# Altium schematic sheet Hotels_Lock_Main_V1.SchDoc
size A3
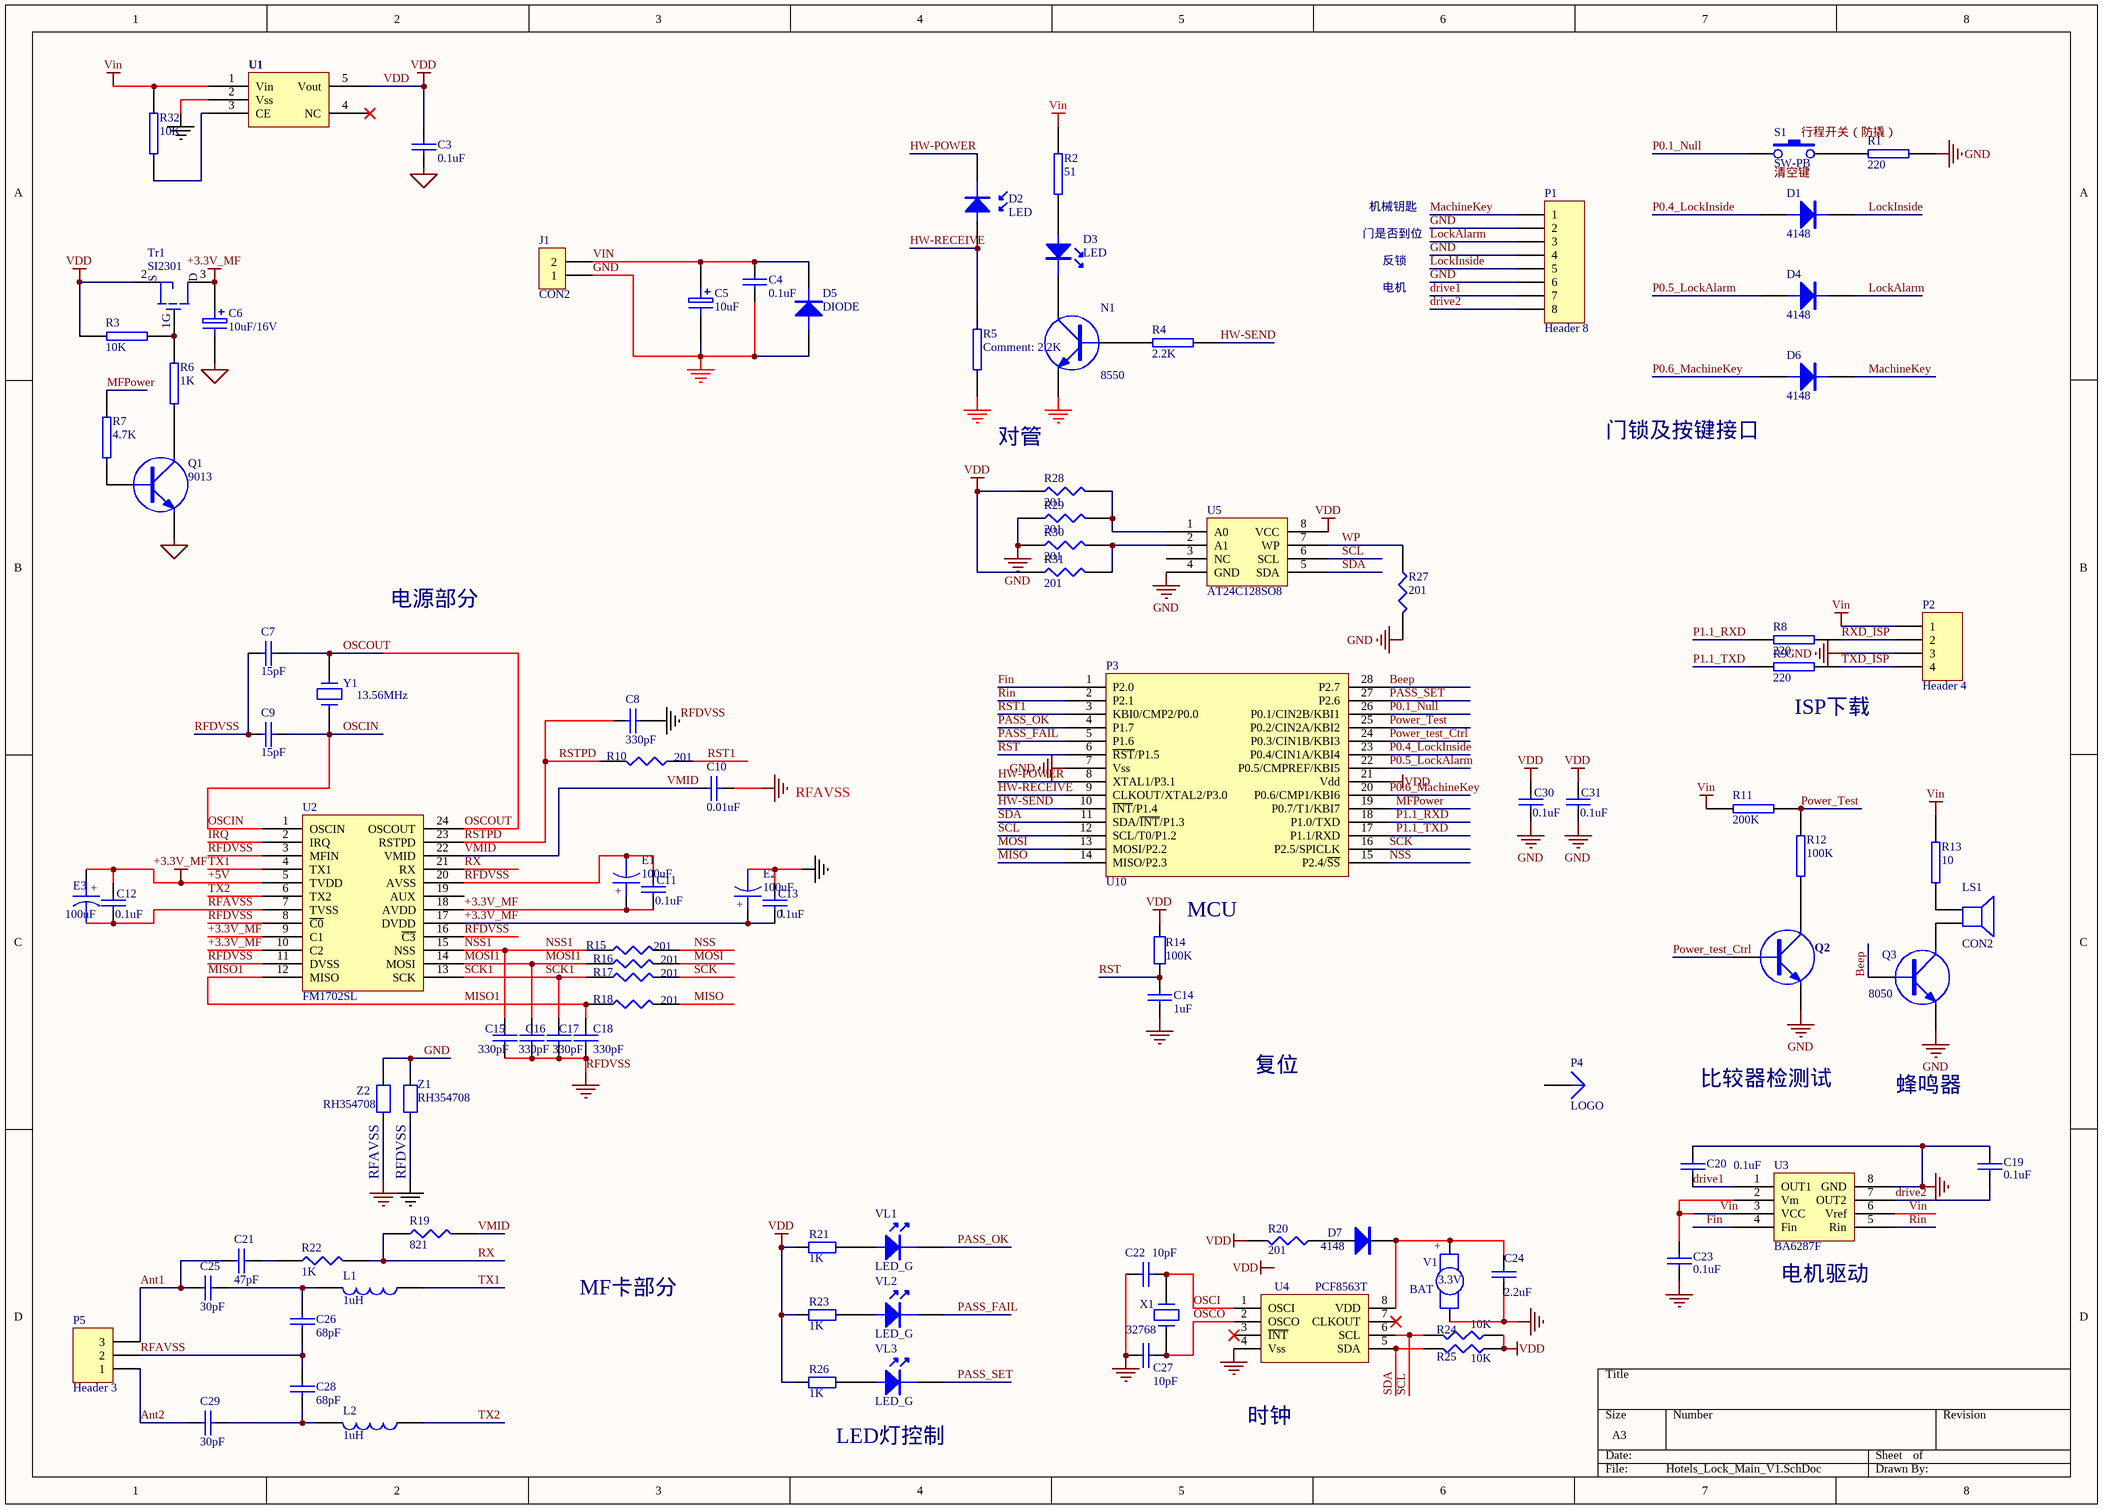
[diagram p0: Hotels_Lock_Main_V1.SchDoc]

## Parts
C3  0.1uF  [0603C]
C4  0.1uF  [0603C]
C5  10uF  [0805EC]
C6  10uF/16V  [1206EC]
C7  15pF  [0603C]
C8  330pF  [0603C]
C9  15pF  [0603C]
C10  0.01uF  [0603C]
C11  0.1uF  [0603C]
C12  0.1uF  [0603C]
C13  0.1uF  [0603C]
C14  1uF  [0603C]
C15  330pF  [0603C]
C16  330pF  [0603C]
C17  330pF  [0603C]
C18  330pF  [0603C]
C19  0.1uF  [0603C]
C20  0.1uF  [0603C]
C21  47pF  [0805C]
C22  10pF  [0603C]
C23  0.1uF  [0603C]
C24  2.2uF  [0603C]
C25  30pF  [0805C]
C26  68pF  [0805C]
C27  10pF  [0603C]
C28  68pF  [0805C]
C29  30pF  [0805C]
C30  0.1uF  [0603C]
C31  0.1uF  [0603C]
D1  4148  [1206D_1]
D2  LED  [LED1_R]
D3  LED  [LED1_S]
D4  4148  [1206D_1]
D5  DIODE  [1206D_1]
D6  4148  [1206D_1]
D7  4148  [1206D_1]
E1  100uF  [1206EC]
E2  100uF  [1206EC]
E3  100uF  [1206EC]
J1  CON2  [CON2-2]
L1  1uH  [L1]
L2  1uH  [L1]
LS1  CON2  [BUZA_M]
N1  8550  [ST-SOT23]
P1  Header 8  [CON8-2]
P2  Header 4  [HDR1X4]
P3  U10  [TSSOP28]
P4  LOGO  [LOGO_apoton]
P5  Header 3  [CON3-2]
Q1  9013  [SOT-23]
Q2  8050  [SOT-23]  (value not drawn)
Q3  8050  [SOT-23]
R1  220  [0603R]
R2  51  [0603R]
R3  10K  [0603R]
R4  2.2K  [0603R]
R5  2.2K  [0603R]
R6  1K  [0603R]
R7  4.7K  [0603R]
R8  220  [0603R]
R9  220  [0603R]
R10  201  [0603R]
R11  200K  [0603R]
R12  100K  [0603R]
R13  10  [0603R]
R14  100K  [0603R]
R15  201  [0603R]
R16  201  [0603R]
R17  201  [0603R]
R18  201  [0603R]
R19  821  [0805R]
R20  201  [0603R]
R21  1K  [0603R]
R22  1K  [0805R]
R23  1K  [0603R]
R24  10K  [0603R]
R25  10K  [0603R]
R26  1K  [0603R]
R27  201  [0603R]
R28  201  [0603R]
R29  201  [0603R]
R30  201  [0603R]
R31  201  [0603R]
R32  10K  [0603R]
S1  SW-PB  [KEY-B4]
Tr1  SI2301  [SOT-23]
U1  XC6201P332MR  [SOT-25]  (value not drawn)
U2  FM1702SL  [SO24W]
U3  BA6287F  [SOP-8]
U4  PCF8563T  [SOP-8]
U5  AT24C128SO8  [SOP-8]
V1  BAT  [SMBAT]
VL1  LED_G  [0805EC_2]
VL2  LED_G  [0805EC_2]
VL3  LED_G  [0805EC_2]
X1  32768  [XTAL3]
Y1  13.56MHz  [CIZHU]
Z1  RH354708  [L1]
Z2  RH354708  [L1]

## Nets
+3.3V_MF: C6.1 C11.2 C12.1 C13.2 E1.1 E2.1 E3.1 Tr1.3 U2.5(TVDD) U2.9(C1) U2.10(C2) U2.17(DVDD) U2.18(AVDD)  [also labelled +5V]
GND: C3.2 C4.2 C5.2 C6.2 C14.1 C19.1 C20.2 C22.1 C23.2 C24.2 C27.1 C30.2 C31.2 D5.1(A) J1.1 N1.E P1.2 P1.4 P1.6 P2.3 P3.7(Vss) Q1.2(E) Q2.2(E) Q3.3(E) R1.2 R5.2 R27.2 R29.1 R30.1 U1.2(Vss) U3.8(GND) U4.4(Vss) U5.4(GND) V1.2(-) Z1.2 Z2.2
RFAVSS: C10.2 C12.2 C26.1 C28.2 E3.2 P5.2 U2.7(TVSS) Z2.1
RFDVSS: C7.1 C8.2 C9.1 C11.1 C13.1 C15.2 C16.2 C17.2 C18.2 E1.2 E2.2 U2.3(MFIN) U2.8(~{C0}) U2.11(DVSS) U2.16(~{C3}) U2.20(AVSS) Z1.1
VDD: C3.1 C30.1 C31.1 P3.21(Vdd) R3.1 R14.1 R20.2 R21.1 R23.1 R24.1 R25.1 R26.1 R28.1 R31.1 Tr1.2 U1.5(Vout) U5.8(VCC)
Vin: C4.1 C5.1 C23.1 D5.2(K) J1.2 P2.1 R2.2 R11.1 R13.1 R32.2 U1.1(Vin) U3.2(Vm) U3.3(VCC) U3.6(Vref)
Ant1: C21.2 C25.2 P5.3
Ant2: C29.2 P5.1
Beep: P3.28(P2.7) Q3.1(B)
drive1: C20.1 P1.7 U3.1(OUT1)
drive2: C19.2 P1.8 U3.7(OUT2)
Fin: P3.1(P2.0) U3.4(Fin)
HW-POWER: D2.2 P3.8(XTAL1/P3.1)
HW-RECEIVE: D2.1 P3.9(CLKOUT/XTAL2/P3.0) R5.1
HW-SEND: P3.10(~{INT}/P1.4) R4.1
IRQ: U2.2(IRQ)
LockAlarm: D4.2(K) P1.3
LockInside: D1.2(K) P1.5
MachineKey: D6.2(K) P1.1
MFPower: P3.19(P0.7/T1/KBI7) R7.1
MISO: P3.14(MISO/P2.3) R18.2
MISO1: C18.1 R18.1 U2.12(MISO)
MOSI: P3.13(MOSI/P2.2) R16.2
MOSI1: C16.1 R16.1 U2.14(MOSI)
NSS: P3.15(P2.4/~{SS}) R15.2
NSS1: C15.1 R15.1 U2.15(NSS)
OSCI: C22.2 U4.1(OSCI) X1.2
OSCIN: C9.2 U2.1(OSCIN) Y1.1
OSCO: C27.2 U4.2(OSCO) X1.1
OSCOUT: C7.2 U2.24(OSCOUT) Y1.2
P0.1_Null: P3.26(P0.1/CIN2B/KBI1) S1.1
P0.4_LockInside: D1.1(A) P3.23(P0.4/CIN1A/KBI4)
P0.5_LockAlarm: D4.1(A) P3.22(P0.5/CMPREF/KBI5)
P0.6_MachineKey: D6.1(A) P3.20(P0.6/CMP1/KBI6)
P1.1_RXD: P3.18(P1.0/TXD) R8.1
P1.1_TXD: P3.17(P1.1/RXD) R9.1
PASS_FAIL: P3.5(P1.6) VL2.2
PASS_OK: P3.4(P1.7) VL1.2
PASS_SET: P3.27(P2.6) VL3.2
Power_Test: P3.25(P0.2/CIN2A/KBI2) R11.2 R12.1
Power_test_Ctrl: P3.24(P0.3/CIN1B/KBI3) Q2.1(B)
Rin: P3.2(P2.1) U3.5(Rin)
RST: C14.2 P3.6(~{RST}/P1.5) R14.2
RST1: P3.3(KBI0/CMP2/P0.0) R10.1
RSTPD: C8.1 R10.2 U2.23(RSTPD)
RX: R19.1 R22.2 U2.21(RX)
RXD_ISP: P2.2 R8.2
SCK: P3.16(P2.5/SPICLK) R17.2
SCK1: C17.1 R17.1 U2.13(SCK)
SCL: P3.12(SCL/T0/P1.2) R24.2 U4.6(SCL) U5.6(SCL)
SDA: P3.11(SDA/~{INT}/P1.3) R25.2 U4.5(SDA) U5.5(SDA)
TX1: L1.1 U2.4(TX1)
TX2: L2.1 U2.6(TX2)
TXD_ISP: P2.4 R9.2
VMID: C10.1 R19.2 U2.22(VMID)
WP: R27.1 U5.7(WP)
NetC21_1: C21.1 R22.1
NetC24_1: C24.1 D7.2 U4.8(VDD) V1.1(+)
NetC25_1: C25.1 C26.2 L1.2
NetC28_1: C28.1 C29.1 L2.2
NetD3_1: D3.1(K) N1.C
NetD3_2: D3.2(A) R2.1
NetD7_1: D7.1 R20.1
NetLS1_1: LS1.1 R13.2
NetLS1_2: LS1.2 Q3.2(C)
NetN1_B: N1.B R4.2
NetQ1_1: Q1.1(B) R7.2
NetQ1_3: Q1.3(C) R6.2
NetQ2_3: Q2.3(C) R12.2
NetR1_1: R1.1 S1.2
NetR3_2: R3.2 R6.1 Tr1.1
NetR21_2: R21.2 VL1.1
NetR23_2: R23.2 VL2.1
NetR26_2: R26.2 VL3.1
NetR28_2: R28.2 R29.2 U5.1(A0)
NetR30_2: R30.2 R31.2 U5.2(A1)
NetR32_1: R32.1 U1.3(CE)

Not connected (* = marked no-connect by the designer): P4 1; U1 4(NC)*; U2 19(AUX); U4 3(~{INT})* 7(CLKOUT)*; U5 3(NC)

## Notes on the sheet
- 门是否到位
- 机械钥匙
- 电机
- 反锁
- 对管
- 门锁及按键接口
- 电源部分
- (near R9) ISP下载
- RFAVSS
- MCU
- 复位
- 比较器检测试
- 蜂鸣器
- RFDVSS
- MF卡部分
- (near V1) 3.3V
- (near U3) 电机驱动
- LED灯控制
- 时钟
- Labels drawn without touching a wire or pin: RFDVSS, VDD, 清空键, 行程开关（防撬）
- (in symbol CAPACITOR POL) +
- (in symbol SI2301) S; D; G

## Library data of the parts
C3 C4 C7-C10 C14-C18 C21 C22 C24-C29 = CAP: Capacitor
C5 C6 = ELECTRO1: Electrolytic Capacitor
C11-C13 C19 C20 C23 C30 C31 = CAP
D1 D4 D6 D7 = DIODE
D2 = LED_1
E1-E3 = CAPACITOR POL
J1 = CON2: Connector
L1 L2 = INDUCTOR
LS1 = SPEAKER
N1 Q1-Q3 = NPN: NPN Transistor
P1 = Header 8: Header, 8-Pin; LatestRevisionDate: 17-Jul-2002; LatestRevisionNote: Re-released for DXP Platform.; Publisher: Altium Limited
P2 = Header 4: Header, 4-Pin; LatestRevisionDate: 17-Jul-2002; LatestRevisionNote: Re-released for DXP Platform.; Publisher: Altium Limited
P3 = P89LPC930_931
P4 = Plug: LatestRevisionDate: 17-Jul-2002; LatestRevisionNote: Re-released for DXP Platform.; Publisher: Altium Limited
P5 = Header 3: Header, 3-Pin; LatestRevisionDate: 17-Jul-2002; LatestRevisionNote: Re-released for DXP Platform.; Publisher: Altium Limited
R1-R9 R11-R13 R32 = RES2
R10 R15-R20 R22 R24 R25 R27-R31 = RES1
R14 = Res2: Resistor; Value: 1K; Published: 8-Jun-2000; LatestRevisionDate: 17-Jul-2002; LatestRevisionNote: Re-released for DXP Platform.; PackageReference: AXIAL-0.4; Publisher: Altium Limited
R21 R23 R26 = Res2: Resistor; Published: 8-Jun-2000; LatestRevisionDate: 17-Jul-2002; LatestRevisionNote: Re-released for DXP Platform.; PackageReference: AXIAL-0.4; Publisher: Altium Limited; Value: 1K
U1 = XC6204
U3 = Component_1
V1 = DIAN SHI
VL1-VL3 = LED1
X1 Y1 = CRYSTAL
Z1 Z2 = Z